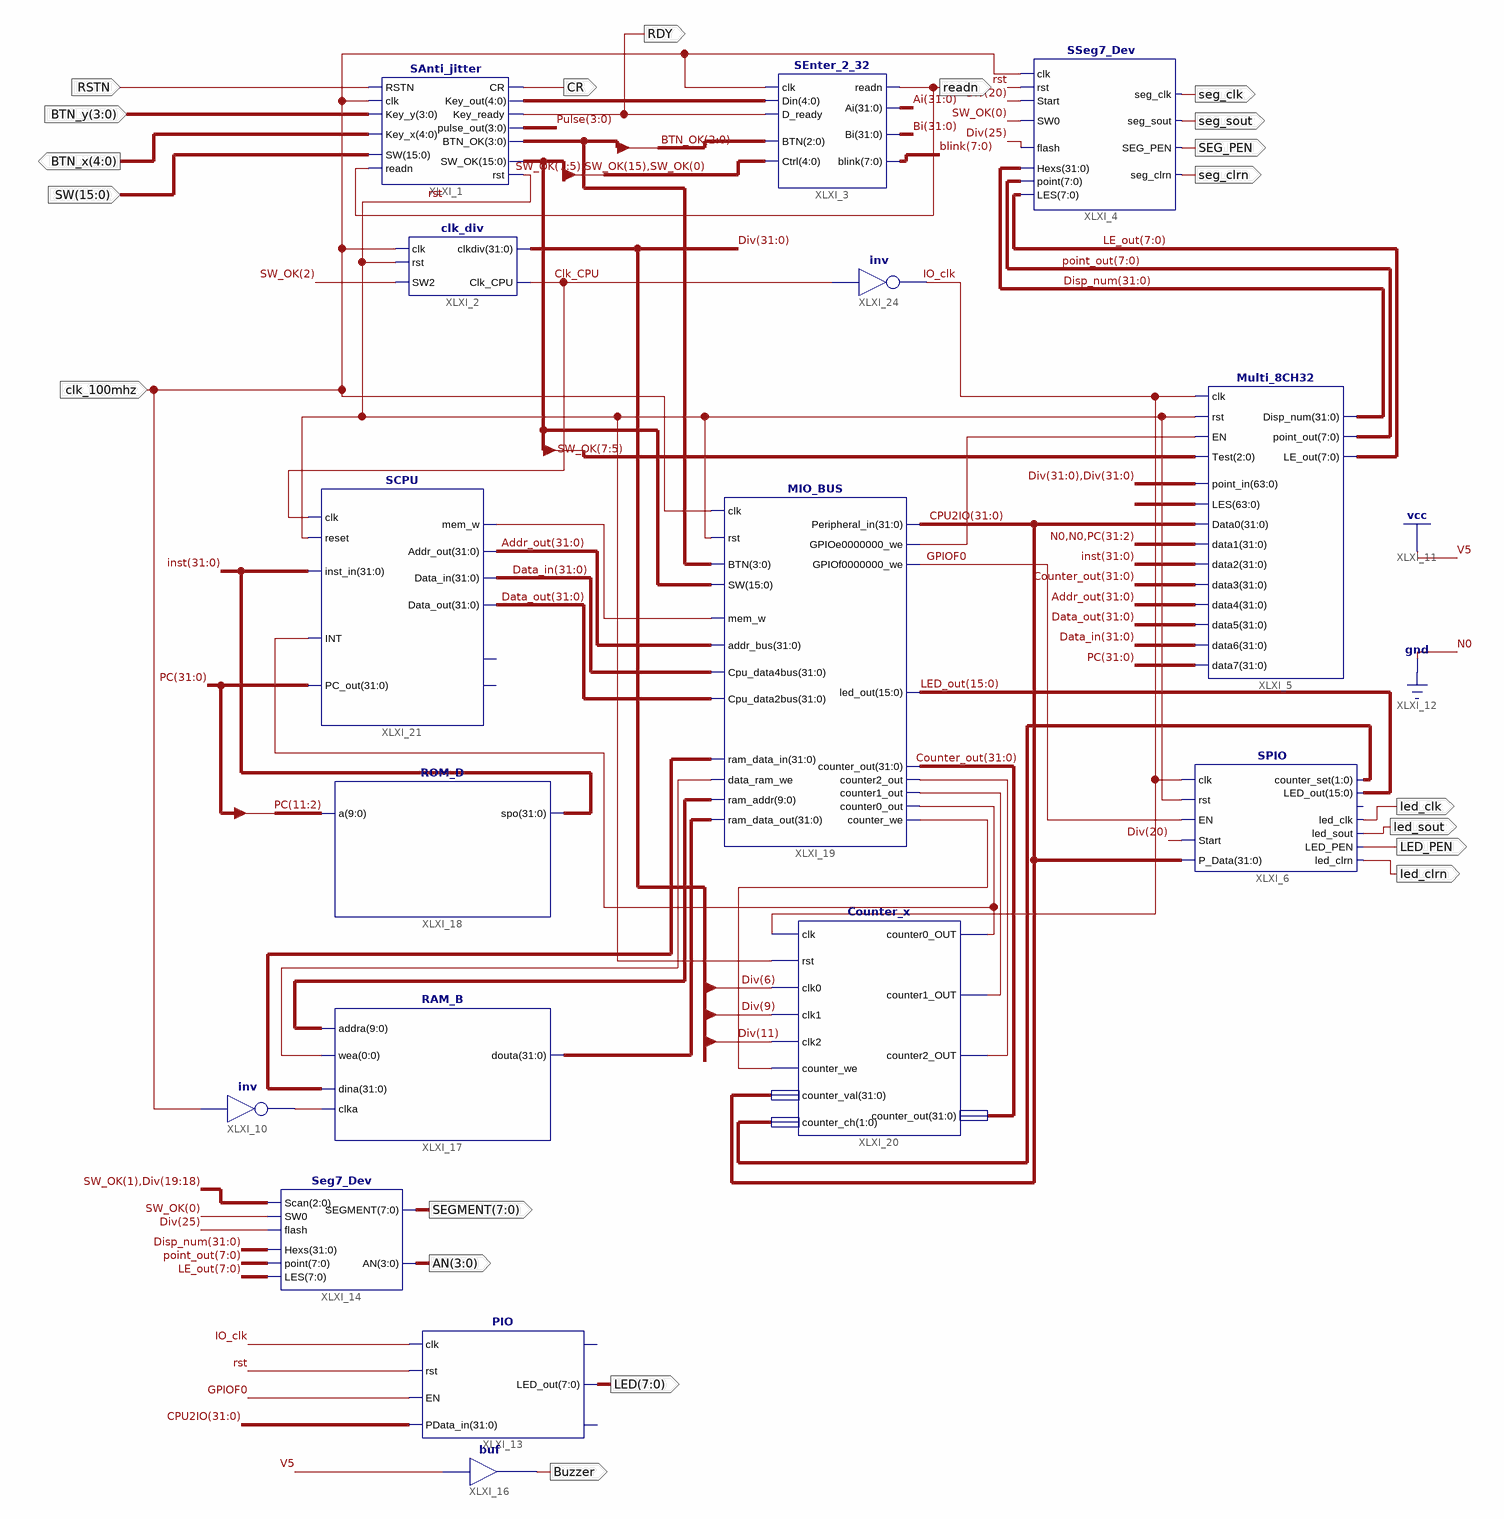
[diagram p0: schematic sheet 1]
// Xilinx ISE schematic OrgLab1.sch (kintex7) as structural Verilog: 16 symbols, 20 ports
module OrgLab1 (
  input  RSTN,
  input  [3:0] BTN_y,
  input  [15:0] SW,
  input  clk_100mhz,
  output [4:0] BTN_x,
  output CR,
  output RDY,
  output readn,
  output seg_clk,
  output seg_sout,
  output SEG_PEN,
  output seg_clrn,
  output led_clk,
  output led_sout,
  output LED_PEN,
  output led_clrn,
  output [7:0] SEGMENT,
  output [3:0] AN,
  output [7:0] LED,
  output Buzzer
);

  wire Clk_CPU, GPIOF0, IO_clk, rst, XLXN_55, XLXN_95, XLXN_122, XLXN_125, XLXN_128, XLXN_130, XLXN_132;
  wire [0:0] XLXN_107;
  wire [1:0] XLXN_123;
  wire [3:0] BTN_OK, Pulse;
  wire [4:0] XLXN_13;
  wire [7:0] blink, LE_out, point_out;
  wire [9:0] XLXN_108;
  wire [15:0] LED_out, SW_OK;
  wire [31:0] Addr_out, Ai, Bi, Counter_out, CPU2IO, Data_in, Data_out, Disp_num, Div, inst, PC, XLXN_106,
       XLXN_114;
  wire [63:0] XLXN_151;

  SAnti_jitter XLXI_1 (
    .SW(SW), .readn(readn), .Key_y(BTN_y), .Key_x(BTN_x), .RSTN(RSTN), .clk(clk_100mhz), .Key_out(XLXN_13),
    .Key_ready(RDY), .CR(CR), .rst(rst), .SW_OK(SW_OK), .pulse_out(Pulse), .BTN_OK(BTN_OK));
  clk_div XLXI_2 (.rst(rst), .clk(clk_100mhz), .SW2(SW_OK[2]), .clkdiv(Div), .Clk_CPU(Clk_CPU));
  SEnter_2_32 XLXI_3 (
    .readn(readn), .Ai(Ai), .Bi(Bi), .blink(blink), .Din(XLXN_13), .D_ready(RDY), .clk(clk_100mhz),
    .Ctrl({SW_OK[7:5], SW_OK[15], SW_OK[0]}), .BTN(BTN_OK[2:0]));
  SSeg7_Dev XLXI_4 (
    .LES(LE_out), .SEG_PEN(SEG_PEN), .seg_sout(seg_sout), .seg_clrn(seg_clrn), .point(point_out),
    .Hexs(Disp_num), .SW0(SW_OK[0]), .flash(Div[25]), .seg_clk(seg_clk), .clk(clk_100mhz), .rst(rst),
    .Start(Div[20]));
  Multi_8CH32 XLXI_5 (
    .Test(SW_OK[7:5]), .point_in({Div, Div}), .EN(XLXN_125), .clk(IO_clk), .rst(rst), .LES(XLXN_151),
    .Data0(CPU2IO), .data1({2'b00, PC[31:2]}), .data2(inst), .data3(Counter_out), .data4(Addr_out),
    .data5(Data_out), .data6(Data_in), .data7(PC), .point_out(point_out), .LE_out(LE_out), .Disp_num(Disp_num));
  SPIO XLXI_6 (
    .clk(IO_clk), .P_Data(CPU2IO), .rst(rst), .EN(GPIOF0), .Start(Div[20]), .led_clk(led_clk),
    .LED_out(LED_out), .counter_set(XLXN_123), .led_clrn(led_clrn), .LED_PEN(LED_PEN), .led_sout(led_sout));  // open: GPIOf0
  not XLXI_10 (XLXN_55, clk_100mhz);
  PIO XLXI_13 (.clk(IO_clk), .rst(rst), .EN(GPIOF0), .PData_in(CPU2IO), .LED_out(LED));  // open: GPIOf0, counter_set
  Seg7_Dev XLXI_14 (
    .LES(LE_out), .Scan({SW_OK[1], Div[19:18]}), .SEGMENT(SEGMENT), .AN(AN), .point(point_out),
    .flash(Div[25]), .SW0(SW_OK[0]), .Hexs(Disp_num));
  RAM_B XLXI_17 (.addra(XLXN_108), .clka(XLXN_55), .wea(XLXN_107[0]), .dina(XLXN_106), .douta(XLXN_114));
  ROM_D XLXI_18 (.a(PC[11:2]), .spo(inst));
  MIO_BUS XLXI_19 (
    .rst(rst), .clk(clk_100mhz), .mem_w(XLXN_95), .addr_bus(Addr_out), .Cpu_data4bus(Data_in),
    .Cpu_data2bus(Data_out), .ram_data_out(XLXN_114), .ram_addr(XLXN_108), .data_ram_we(XLXN_107[0]),
    .ram_data_in(XLXN_106), .counter_out(Counter_out), .counter2_out(XLXN_130), .counter1_out(XLXN_128),
    .counter0_out(XLXN_132), .counter_we(XLXN_122), .BTN(BTN_OK), .SW(SW_OK), .led_out(LED_out),
    .Peripheral_in(CPU2IO), .GPIOe0000000_we(XLXN_125), .GPIOf0000000_we(GPIOF0));
  Counter_x XLXI_20 (
    .clk(IO_clk), .rst(rst), .clk0(Div[6]), .clk1(Div[9]), .clk2(Div[11]), .counter_we(XLXN_122),
    .counter_val(CPU2IO), .counter_ch(XLXN_123), .counter0_OUT(XLXN_132), .counter1_OUT(XLXN_128),
    .counter2_OUT(XLXN_130), .counter_out(Counter_out));
  SCPU XLXI_21 (
    .clk(Clk_CPU), .reset(rst), .inst_in(inst), .INT(XLXN_132), .Addr_out(Addr_out), .mem_w(XLXN_95),
    .Data_out(Data_out), .Data_in(Data_in), .PC_out(PC));  // open: CPU_MIO, MIO_ready
  buf XLXI_16 (Buzzer, 1'b1);
  not XLXI_24 (IO_clk, Clk_CPU);
endmodule
